# Altium schematic sheet OUTPUT HEADERS.SchDoc
size B; Organization: Altium Limited; Address1: L3, 12a Rodborough Rd; Address2: Frenchs Forest; Address3: NSW; Address4: Australia 2086
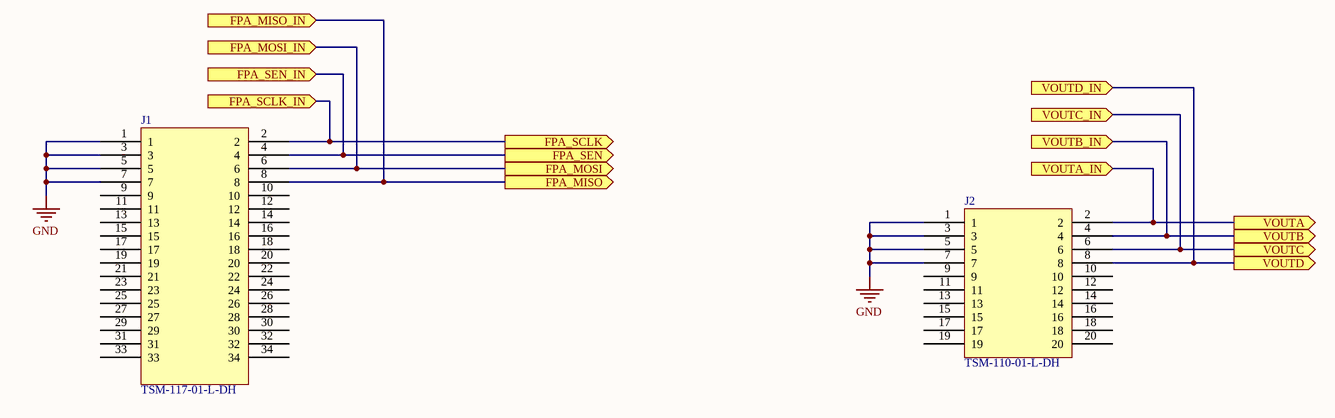
[diagram p0: OUTPUT HEADERS.SchDoc]

## Parts
J1  TSM-117-01-L-DH  [HEADER_25.4MM_17x2_SMT_RA_TOP]
J2  TSM-110-01-L-DH  [HEADER_25.4MM_10x2_SMT_RA_TOP]

## Ports
FPA_MISO (out), FPA_MISO_IN (in), FPA_MOSI (out), FPA_MOSI_IN (in), FPA_SCLK (out), FPA_SCLK_IN (in), FPA_SEN (out), FPA_SEN_IN (in), VOUTA (out), VOUTA_IN (in), VOUTB (out), VOUTB_IN (in), VOUTC (out), VOUTC_IN (in), VOUTD (out), VOUTD_IN (in)

## Nets
GND: J1.1 J1.3 J1.5 J1.7 J2.1 J2.3 J2.5 J2.7
FPA_MISO: J1.8 ; port FPA_MISO, port FPA_MISO_IN
FPA_MOSI: J1.6 ; port FPA_MOSI, port FPA_MOSI_IN
FPA_SCLK: J1.2 ; port FPA_SCLK, port FPA_SCLK_IN
FPA_SEN: J1.4 ; port FPA_SEN, port FPA_SEN_IN
VOUTA: J2.2 ; port VOUTA, port VOUTA_IN
VOUTB: J2.4 ; port VOUTB, port VOUTB_IN
VOUTC: J2.6 ; port VOUTC, port VOUTC_IN
VOUTD: J2.8 ; port VOUTD, port VOUTD_IN

Not connected (* = marked no-connect by the designer): J1 9 10 11 12 13 14 15 16 17 18 19 20 21 22 23 24 25 26 27 28 29 30 31 32 33 34; J2 9 10 11 12 13 14 15 16 17 18 19 20

## Notes on the sheet
- Title
- Size:
- Date:
- B
- Number:
- Time:
- Revision:
- Sheet
- of
- File:

## Library data of the parts
J1 = TSM-117-01-L-DH: Manufacturer: Samtec Inc; Connector Type: Header, Unshrouded; Number of Positions: 34; Number of Positions Loaded: All; Pitch: 0.100" (2.54mm); Description: CONN HEADER 34POS .100" DBL SMD; Packaging: Tube; Contact Type: Male Pin; Number of Rows: 2; Row Spacing: 0.100" (2.54mm); Contact Mating Length: 0.230" (5.84mm); Mounting Type: Surface Mount, Right Angle; Termination: Solder; Fastening Type: -; Features: -; Contact Finish: Gold; Contact Finish Thickness: 10µin (0.25µm); Color: Black; ComponentLink1URL: http://www.samtec.com/documents/webfiles/cpdf/TSM-1XX-XX-XXX-XX-XX-XXX-XX-MKT1.pdf; ComponentLink1Description: http://www.samtec.com/documents/webfiles/cpdf/TSM-1XX-XX-XXX-XX-XX-XXX-XX-MKT1.pdf; Supplier 1: Digi-Key; Supplier Part Number 1: TSM-117-01-L-DH-ND; Manufacturer Part Number: TSM-117-01-L-DH; RoHS: RoHS Compliant; Category: Connectors, Interconnects; Stock 1: 0; Pricing 1: 1=4.47 (USD)
J2 = TSM-110-01-L-DH: Manufacturer: Samtec Inc; Connector Type: Header, Unshrouded; Number of Positions: 20; Number of Positions Loaded: All; Pitch: 0.100" (2.54mm); Description: CONN HEADER 20POS .100" DBL SMD; Packaging: Tube; Contact Type: Male Pin; Number of Rows: 2; Row Spacing: 0.100" (2.54mm); Contact Mating Length: 0.230" (5.84mm); Mounting Type: Surface Mount, Right Angle; Termination: Solder; Fastening Type: -; Features: -; Contact Finish: Gold; Contact Finish Thickness: 10µin (0.25µm); Color: Black; ComponentLink1URL: http://www.samtec.com/documents/webfiles/cpdf/TSM-1XX-XX-XXX-XX-XX-XXX-XX-MKT1.pdf; ComponentLink1Description: http://www.samtec.com/documents/webfiles/cpdf/TSM-1XX-XX-XXX-XX-XX-XXX-XX-MKT1.pdf; Supplier 1: Digi-Key; Supplier Part Number 1: TSM-110-01-L-DH-ND; Manufacturer Part Number: TSM-110-01-L-DH; RoHS: RoHS Compliant; Category: Connectors, Interconnects; Stock 1: 0; Pricing 1: 1=2.63 (USD)